# EAGLE design wiicam-3v3 (EAGLE 5.11)
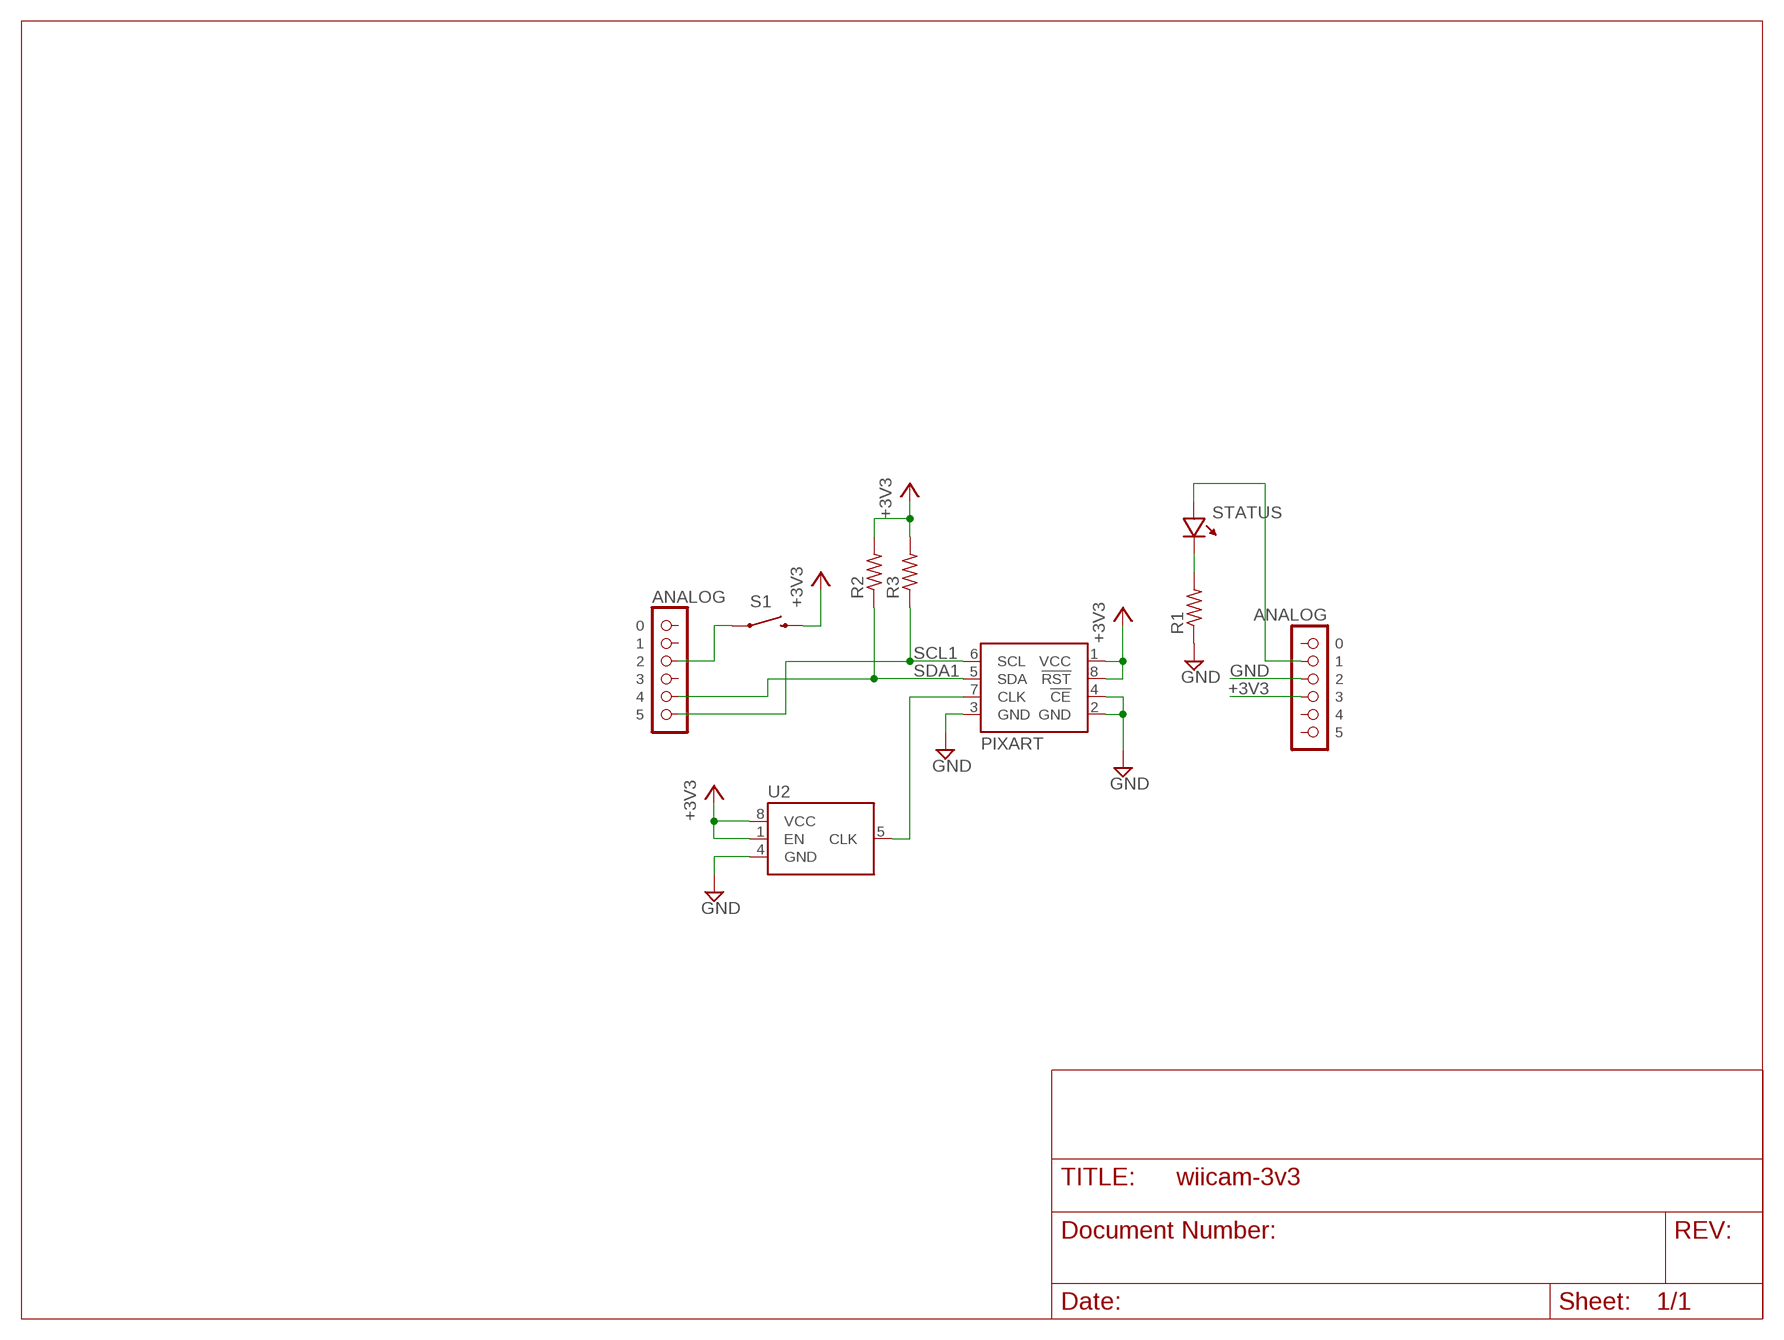
[diagram p0: schematic, sheet 1]

## Parts
R1  R-US_M0805  [M0805]
R2  R-US_M0805  [M0805]
R3  R-US_M0805  [M0805]
S1  SWITCH-MOMENTARY-2PTH  [TACTILE-PTH]
STATUS  LED"  [0805]
U2  ACHL-OSC  [OSC-HALF]
U3  PIXARTVERT  [PIXART-VERT]
U4  ANALOG  [1X06]
U$1  ANALOG  [1X06]

## Nets
+3V3: R2.2 R3.2 S1.3 U2.1(EN) U2.8(VCC) U3.1(VCC) U3.8(!RST) U$1.4
CLK: U2.5(CLK) U3.7(CLK)
GND: R1.1 U2.4(GND) U3.2(GND) U3.3(GND) U3.4(!CE) U$1.3
N$1: S1.1 U4.3
N$26: R1.2 STATUS.2(C)
N$27: STATUS.1(A) U$1.2
SCL1: R3.1 U3.6(SCL) U4.6
SDA1: R2.1 U3.5(SDA) U4.5
Unconnected: U4.1 U4.2 U4.4 U$1.1 U$1.5 U$1.6

## Library data of the parts
R1-R3 = resistor:R-US_: RESISTOR, American symbol
S1 = SparkFun:SWITCH-MOMENTARY-2
STATUS = my-lib:LED: LED
U2 = my-lib:ACHL-OSC: Abracon half-size thru hole oscillator
U3 = my-lib:PIXART: Wiimote IR Camera 8-pin
U4 U$1 = arduino:ANALOG

## Board
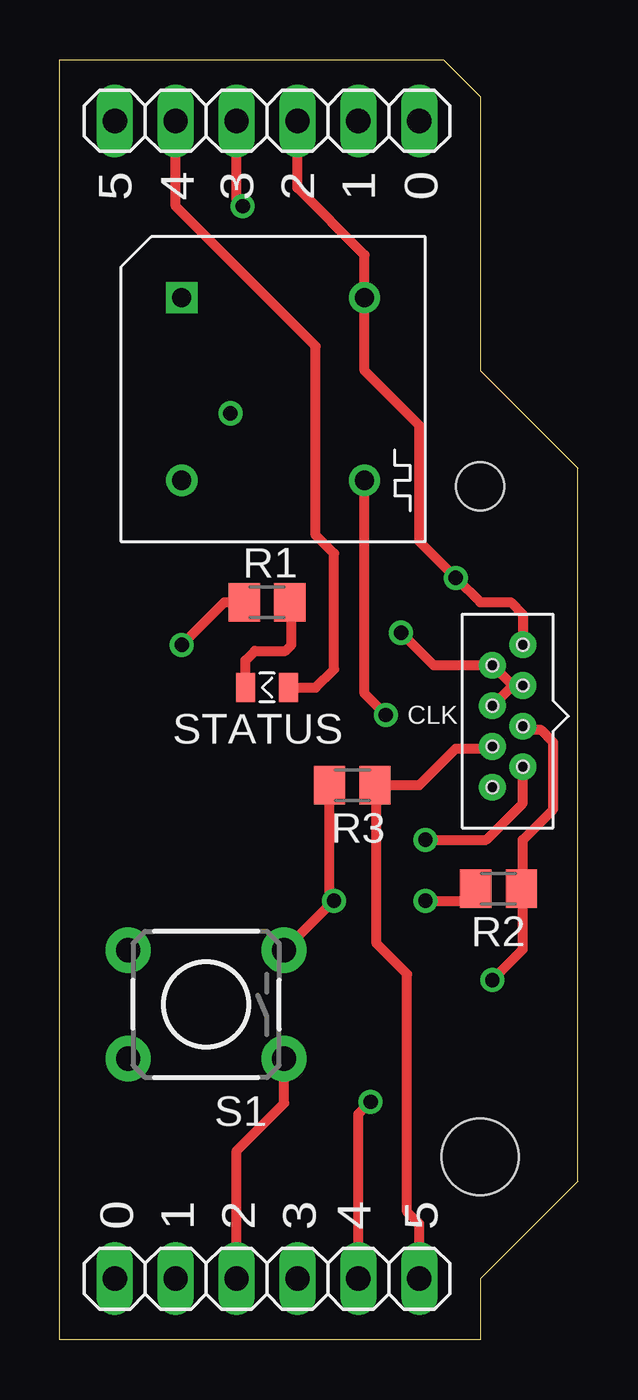
[diagram p1: board, top side]
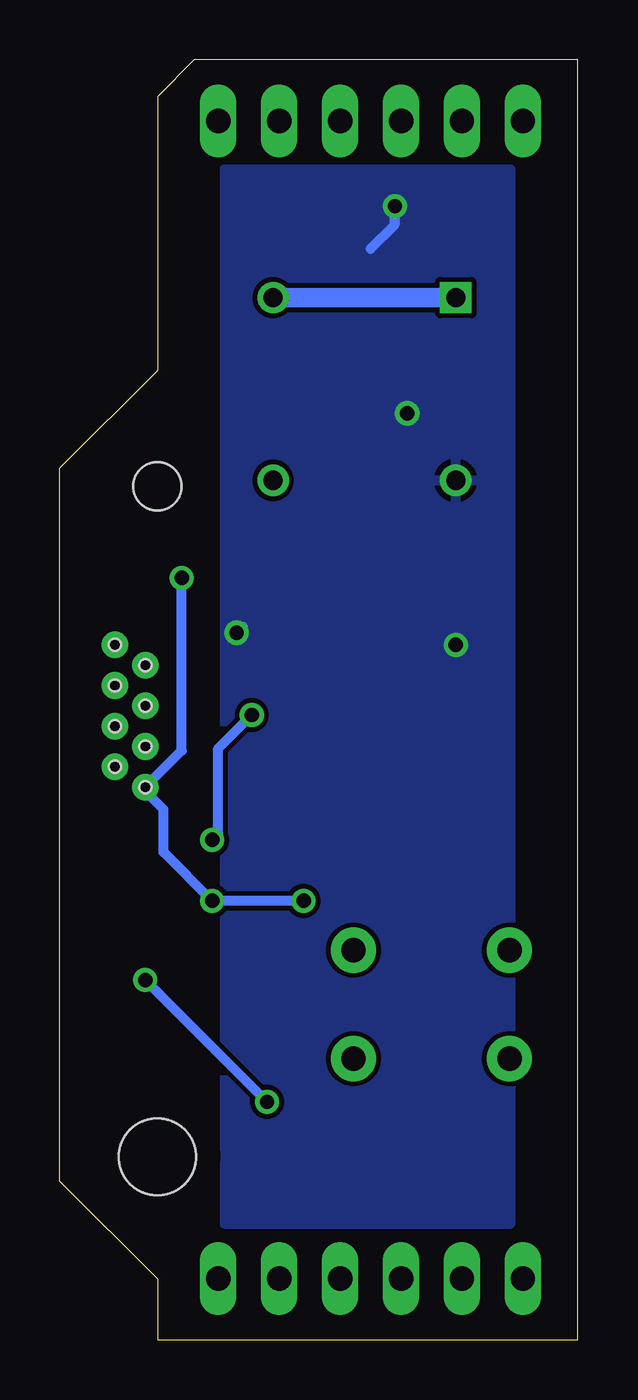
[diagram p2: board, bottom side, seen from below]

Size 21.59 x 53.34 mm. Coordinates in mm from the lower left corner, seen from the top.
Outline: 0,53.34 16,53.34 17.53,51.82 17.53,40.39 21.59,36.32 21.59,6.6 17.53,2.54 17.53,0 0,0 0,53.34
Copper layers (1*16): Top 0.035mm / dielectric 1.5mm / Bottom 0.035mm
Design rules "default": minimum track width 10mil, minimum drill 24mil, track to track 8mil, track to pad 8mil, pad to pad 8mil, via to via 8mil, smd to smd 8mil, copper to edge 40mil, drill to drill 8mil, minimum pad ring 10mil, minimum via ring 8mil, stop-mask expansion 4mil, vias tented up to drill 0mil, thermal gap 10mil
Holes 2 mm at 17.53,35.56
Holes 3.2 mm at 17.53,7.62

### Footprints (pad centres in the part's own frame; a part is rotated, then mirrored left to right if it is on the bottom)
M0805 = smd 1.3 x 1.6: 1 -0.95,0; 2 0.95,0
TACTILE-PTH = drill 1.016 pad 1.88 round: 1 -3.251,2.261; 2 3.251,2.261; 3 -3.251,-2.261; 4 3.251,-2.261
0805 = smd 0.8 x 1.2: 1 -0.9,0; 2 0.9,0
OSC-HALF = drill 0.8 square: 1 -3.81,-3.81 | drill 0.8 round: 4 3.81,-3.81; 5 3.81,3.81; 8 -3.81,3.81
PIXART-VERT = drill 0.6 round: 1 0,0; 2 0.847,-1.27; 3 1.693,0; 4 2.54,-1.27; 5 3.387,0; 6 4.233,-1.27; 7 5.08,0; 8 5.927,-1.27 | hole 0.5: 0,0; 0.847,-1.27; 1.693,0; 2.54,-1.27; 3.387,0; 4.233,-1.27; 5.08,0; 5.927,-1.27
1X06 = drill 1.016 long: 1 -6.35,0; 2 -3.81,0; 3 -1.27,0; 4 1.27,0; 5 3.81,0; 6 6.35,0

### Placement (x,y rotation side)
R1  8.64,30.73 0 top
R2  18.29,18.8 180 top
R3  12.19,23.11 180 top
S1  6.1,13.97 180 top
STATUS  8.64,27.18 180 top
U2  8.89,39.62 270 top
U3  19.3,28.96 270 top
U4  8.64,2.54 0 top
U$1  8.64,50.8 0 top

### Tracks (layer width: path | path; a pad name or v marks a point on that pad's centre or on a via)
+3V3  (via drill 0.6)
  Top 0.254: 11.24,18.12 11.24,18.48
  Top 0.406: U$1.4 9.91,48.01 12.7,45.21 U2.8 12.7,40.39 14.99,38.1 14.99,33.27 v16.51,31.75 17.53,30.73 18.8,30.73 19.3,30.23 U3.1 | U3.8 17.95,23.11 | v15.24,18.29 16.83,18.29 R2.2 | R3.2 11.24,18.48 v11.43,18.29 | S1.3 11.24,18.12
  Bottom 0.406: v16.51,31.75 16.51,24.55 U3.8 18.03,22.86 17.27,22.1 17.27,20.32 v15.24,18.29 v11.43,18.29
  Bottom 0.813: U2.8 U2.1
CLK  (via drill 0.6)
  Top 0.406: U2.5 12.7,26.92 v13.59,26.04 | v15.24,20.83 17.78,20.83 19.3,22.35 U3.7
  Bottom 0.406: v13.59,26.04 14.99,24.64 14.99,21.08 v15.24,20.83
GND  (via drill 0.6)
  Top 0.406: R1.1 6.86,30.73 v5.08,28.96 | U$1.3 7.37,47.5 v7.62,47.24 | 18.88,27.26 U3.3 18.88,27.26 | 18.88,27.26 U3.4 | 18.88,27.26 U3.2 15.58,28.11 v14.22,29.46
  Bottom 0.406: v7.62,47.24 7.62,46.48 8.64,45.47 | v14.22,29.46 13.97,29.72
  other vias: 7.11,38.61
  pour Bottom: 14.73,48.77 14.73,4.83 2.79,4.83 2.79,48.77
N$1
  Top 0.406: S1.1 9.35,9.86 7.37,7.87 U4.3
N$26
  Top 0.406: 9.54,30.73 R1.2 9.65,30.67 9.65,28.96 9.4,28.7 8.13,28.7 7.74,28.31 STATUS.2
N$27
  Top 0.406: U$1.2 4.83,47.24 10.67,41.4 10.67,33.53 11.43,32.77 11.43,27.94 10.67,27.18 STATUS.1
SCL1
  Top 0.406: U3.6 17.95,24.64 16.51,24.64 14.99,23.11 R3.1 13.21,23.05 13.21,16.51 14.48,15.24 14.48,5.33 14.99,4.83 U4.6
SDA1  (via drill 0.6)
  Top 0.406: U3.5 19.47,25.4 20.07,25.4 20.57,24.89 20.57,22.1 19.3,20.83 19.3,18.8 R2.1 19.3,18.73 19.3,16.26 v18.03,14.99 | U4.5 12.45,9.4 v12.95,9.91
  Bottom 0.406: v12.95,9.91 v18.03,14.99

### Text on the board
tPlace: CLK
tNames: 5 | 4 | 3 | 2 | 1 | 0 | 0 | 1 | 2 | 3 | 4 | 5
tDocu: WiiCam V0.2
ArduinoHoles: 2.2mm | 3.2mm